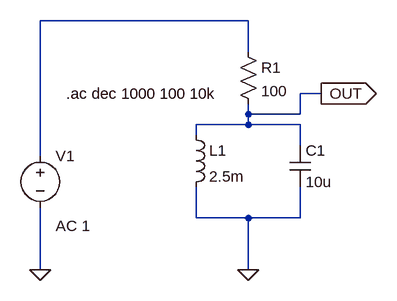
[diagram p0: schematic 1_1ACkaiseki.asc]
1_1ACkaiseki.asc, the LTspice schematic file:
Version 4
SHEET 1 880 680
WIRE 400 -80 80 -80
WIRE 400 -32 400 -80
WIRE 512 32 480 32
WIRE 400 64 400 48
WIRE 480 64 480 32
WIRE 480 64 400 64
WIRE 400 80 400 64
WIRE 400 80 320 80
WIRE 480 80 400 80
WIRE 320 96 320 80
WIRE 480 112 480 80
WIRE 80 128 80 -80
WIRE 320 224 320 176
WIRE 400 224 320 224
WIRE 480 224 480 176
WIRE 480 224 400 224
WIRE 80 304 80 208
WIRE 400 304 400 224
FLAG 400 304 0
FLAG 80 304 0
FLAG 512 32 OUT
IOPIN 512 32 Out
SYMBOL voltage 80 112 R0
WINDOW 123 24 124 Left 2
WINDOW 39 0 0 Left 0
SYMATTR InstName V1
SYMATTR Value ""
SYMATTR Value2 AC 1
SYMBOL res 384 -48 R0
SYMATTR InstName R1
SYMATTR Value 100
SYMBOL ind 304 80 R0
SYMATTR InstName L1
SYMATTR Value 2.5m
SYMBOL cap 464 112 R0
SYMATTR InstName C1
SYMATTR Value 10u
TEXT 120 32 Left 2 !.ac dec 1000 100 10k

The netlist it stands for:
* 1_1ACkaiseki.asc
V1 N001 0 AC 1
R1 N001 OUT 100
L1 OUT 0 2.5m
C1 OUT 0 10u
.ac dec 1000 100 10k
.backanno
.end